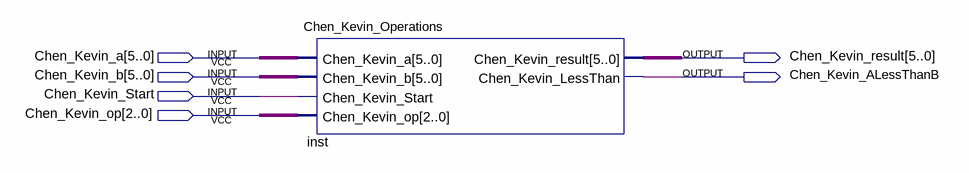
[diagram p0: schematic sheet]
// Quartus schematic Chen_Kevin_Bitwise.bdf as structural Verilog: 1 symbols, 6 pins
module Chen_Kevin_Bitwise (
  input  [5:0] Chen_Kevin_a,
  input  [5:0] Chen_Kevin_b,
  input  Chen_Kevin_Start,
  input  [2:0] Chen_Kevin_op,
  output [5:0] Chen_Kevin_result,
  output Chen_Kevin_ALessThanB
);

  Chen_Kevin_Operations inst (
    .Chen_Kevin_a(Chen_Kevin_a), .Chen_Kevin_b(Chen_Kevin_b), .Chen_Kevin_Start(Chen_Kevin_Start),
    .Chen_Kevin_op(Chen_Kevin_op), .Chen_Kevin_result(Chen_Kevin_result),
    .Chen_Kevin_LessThan(Chen_Kevin_ALessThanB));
endmodule
